# EAGLE design Strain guage (EAGLE 9.6.2)
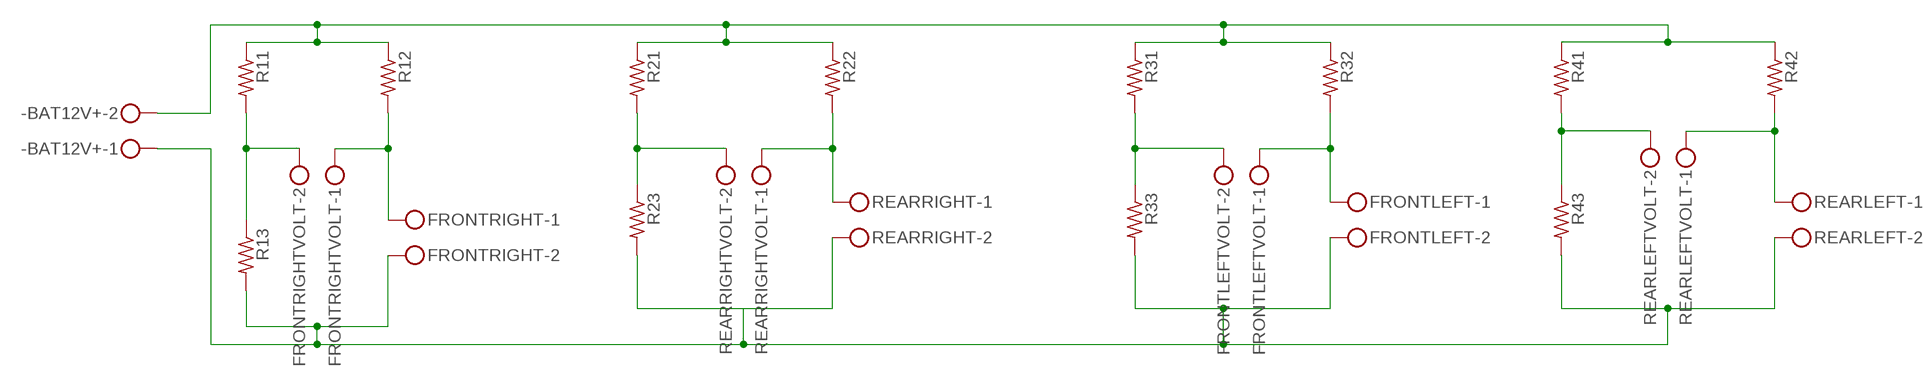
[diagram p0: schematic, sheet 1]

## Parts
-BAT12V+  MKDSN1,5/2-5,08  [MKDSN1,5/2-5,08]
FRONTLEFT  MKDSN1,5/2-5,08  [MKDSN1,5/2-5,08]
FRONTLEFTVOLT  MKDSN1,5/2-5,08  [MKDSN1,5/2-5,08]
FRONTRIGHT  MKDSN1,5/2-5,08  [MKDSN1,5/2-5,08]
FRONTRIGHTVOLT  MKDSN1,5/2-5,08  [MKDSN1,5/2-5,08]
R11  R-US_0204/7  [0204/7]
R12  R-US_0204/7  [0204/7]
R13  R-US_0204/7  [0204/7]
R21  R-US_0204/7  [0204/7]
R22  R-US_0204/7  [0204/7]
R23  R-US_0204/7  [0204/7]
R31  R-US_0204/7  [0204/7]
R32  R-US_0204/7  [0204/7]
R33  R-US_0204/7  [0204/7]
R41  R-US_0204/7  [0204/7]
R42  R-US_0204/7  [0204/7]
R43  R-US_0204/7  [0204/7]
REARLEFT  MKDSN1,5/2-5,08  [MKDSN1,5/2-5,08]
REARLEFTVOLT  MKDSN1,5/2-5,08  [MKDSN1,5/2-5,08]
REARRIGHT  MKDSN1,5/2-5,08  [MKDSN1,5/2-5,08]
REARRIGHTVOLT  MKDSN1,5/2-5,08  [MKDSN1,5/2-5,08]

## Nets
N$1: -BAT12V+.2 R11.1 R12.1 R21.1 R22.1 R31.1 R32.1 R41.1 R42.1
N$2: FRONTRIGHTVOLT.2 R11.2 R13.1
N$3: -BAT12V+.1 FRONTLEFT.2 FRONTRIGHT.2 R13.2 R23.2 R33.2 R43.2 REARLEFT.2 REARRIGHT.2
N$4: FRONTRIGHT.1 FRONTRIGHTVOLT.1 R12.2
N$5: R21.2 R23.1 REARRIGHTVOLT.2
N$8: R22.2 REARRIGHT.1 REARRIGHTVOLT.1
N$9: FRONTLEFTVOLT.2 R31.2 R33.1
N$11: FRONTLEFT.1 FRONTLEFTVOLT.1 R32.2
N$12: R41.2 R43.1 REARLEFTVOLT.2
N$14: R42.2 REARLEFT.1 REARLEFTVOLT.1

## Library data of the parts
-BAT12V+ FRONTLEFT FRONTLEFTVOLT FRONTRIGHT FRONTRIGHTVOLT REARLEFT REARLEFTVOLT REARRIGHT REARRIGHTVOLT = con-phoenix-508:MKDSN1,5/2-5,08: MKDSN 1,5/ 2-5,08 Printklemme Nennstrom: 13,5 A Nennspannung: 250 V Rastermaß: 5,08 mm Polzahl: 2 Anschlussart: Schraubanschluss Montage: Löten Anschlussrichtung Leiter/Platine: 0 ° Artikelnummer: 1729128 Source: http://eshop.phoenixcontact.com .. 1729128.pdf
R11-R13 R21-R23 R31-R33 R41-R43 = rcl:R-US_: RESISTOR, American symbol; SPICEPREFIX: R

## Board
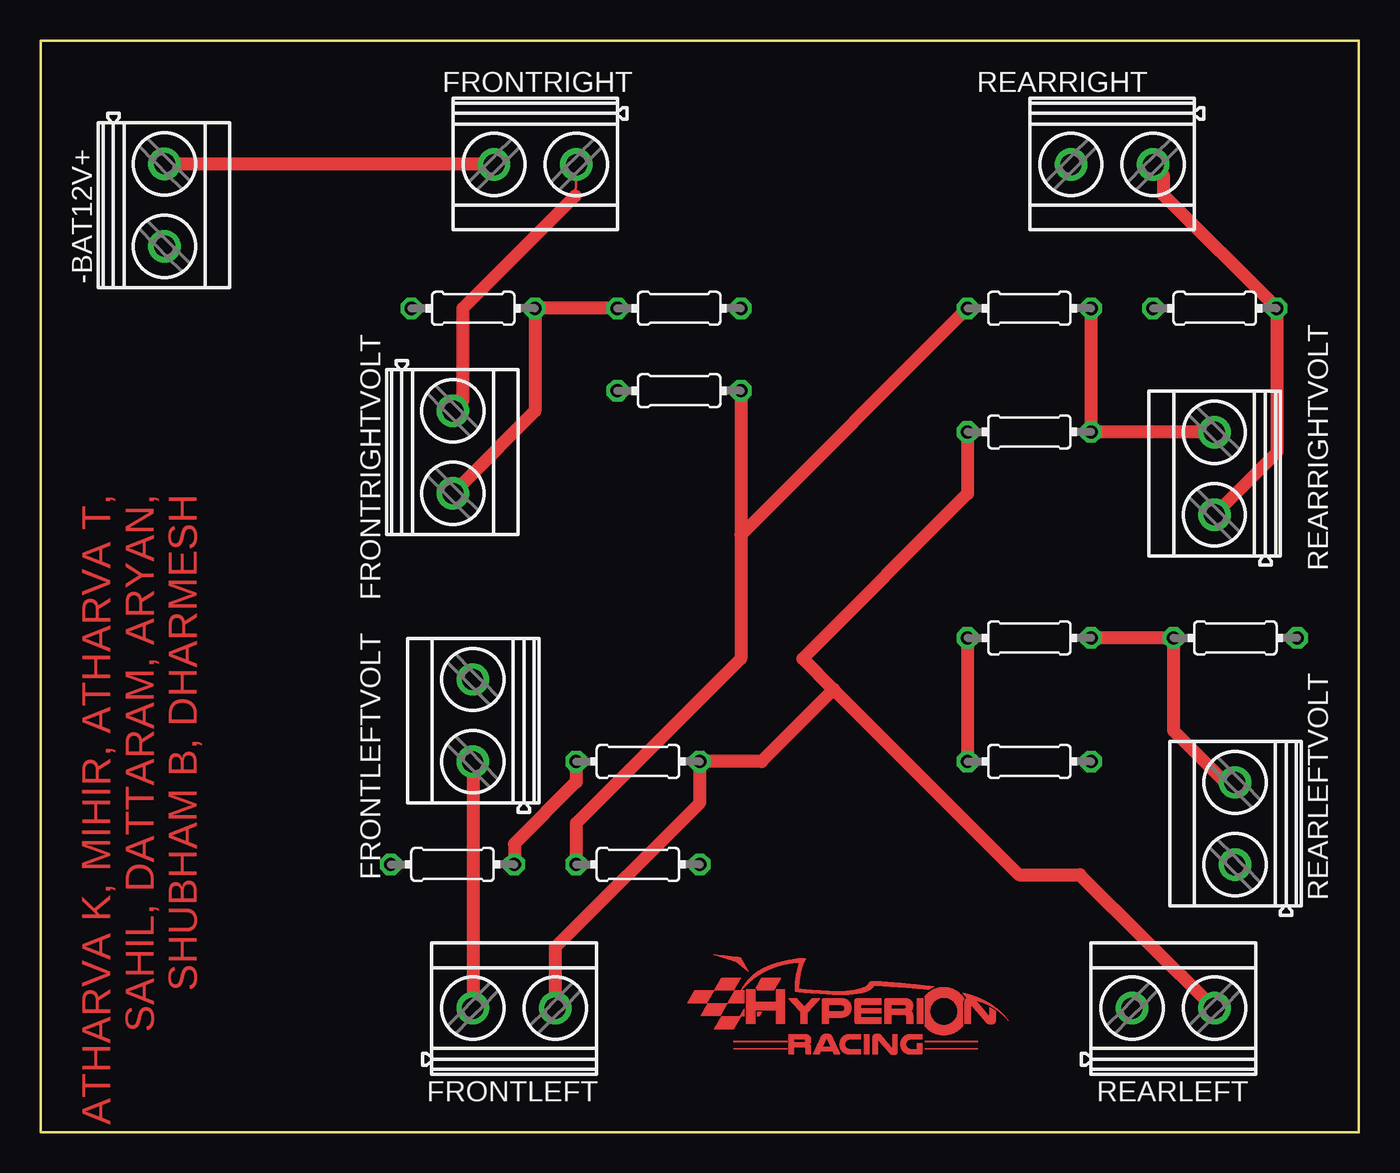
[diagram p1: board, top side]
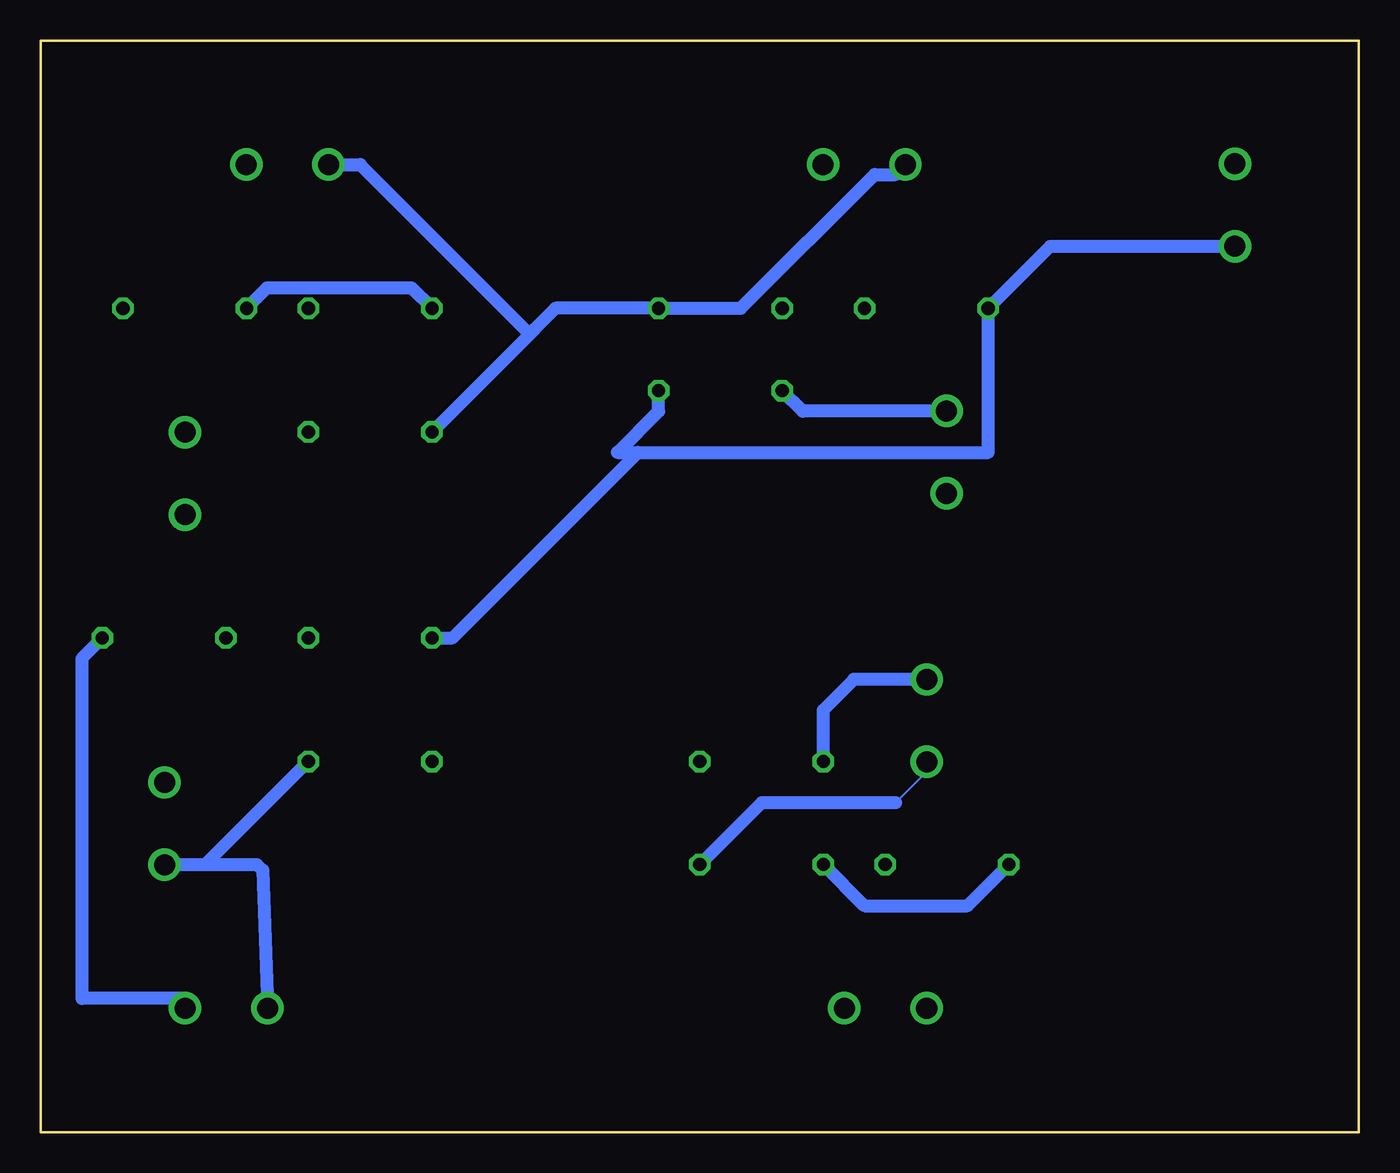
[diagram p2: board, bottom side, seen from below]

Size 81.28 x 67.31 mm. Coordinates in mm from the lower left corner, seen from the top.
Outline: 0,67.31 0,0 81.28,0 81.28,67.31 0,67.31
Copper layers (1*16): Top 0.035mm / dielectric 1.5mm / Bottom 0.035mm
Design rules "default": minimum track width 6mil, minimum drill 0.35mm, track to track 6mil, track to pad 6mil, pad to pad 6mil, via to via 6mil, smd to smd 6mil, copper to edge 40mil, drill to drill 6mil, minimum pad ring 10mil, minimum via ring 8mil, stop-mask expansion 4mil, vias tented up to drill 0mil, thermal gap 10mil

### Footprints (pad centres in the part's own frame; a part is rotated, then mirrored left to right if it is on the bottom)
MKDSN1,5/2-5,08 = drill 1.3 pad 2: 1 -2.561,0.025; 2 2.519,0.025
0204/7 = drill 0.813 octagon: 1 -3.81,0; 2 3.81,0

### Placement (x,y rotation side)
-BAT12V+  7.62,57.15 270 top
FRONTLEFT  29.21,7.62 0 top
FRONTLEFTVOLT  26.67,25.4 90 top
FRONTRIGHT  30.48,59.69 180 top
FRONTRIGHTVOLT  25.4,41.91 270 top
R11  26.67,50.8 0 top
R12  39.37,45.72 180 top
R13  39.37,50.8 0 top
R21  60.96,50.8 0 top
R22  72.39,50.8 0 top
R23  60.96,43.18 180 top
R31  25.4,16.51 0 top
R32  36.83,16.51 0 top
R33  36.83,22.86 0 top
R41  60.96,30.48 0 top
R42  60.96,22.86 0 top
R43  73.66,30.48 0 top
REARLEFT  69.85,7.62 0 top
REARLEFTVOLT  73.66,19.05 90 top
REARRIGHT  66.04,59.69 180 top
REARRIGHTVOLT  72.39,40.64 90 top

### Tracks (layer width: path | path; a pad name or v marks a point on that pad's centre or on a via)
N$1
  Top 0.813: R41.1 R42.1 | R32.1 33.02,19.05 43.18,29.21 43.18,36.83 | R12.1 43.18,36.83 | 43.18,36.83 R21.1
  Bottom 0.152: 8.25,54.61 -BAT12V+.2
  Bottom 0.813: 8.25,54.61 19.05,54.61 R11.1 22.86,41.91 44.45,41.91 | R21.1 58.42,52.07 67.31,52.07 R22.1 | R31.1 24.13,13.97 30.48,13.97 R32.1 | 44.45,41.91 55.88,30.48 R41.1 | R12.1 43.18,44.45 45.72,41.91 44.45,41.91
N$2
  Top 0.152: 26.04,40.01 FRONTRIGHTVOLT.2
  Top 0.813: R13.1 R11.2 30.48,44.45 26.04,40.01
N$3
  Top 0.152: 31.75,8.26 FRONTLEFT.2 | 8.25,59.69 -BAT12V+.1 | 27.94,59.69 FRONTRIGHT.2
  Top 0.813: 31.75,8.26 31.75,11.43 40.64,20.32 R33.2 44.45,22.86 48.89,27.3 | 27.94,59.69 8.25,59.69 | R23.2 57.15,39.37 46.99,29.21 48.89,27.3 | 48.89,27.3 60.33,15.87 64.09,15.87 REARLEFT.2
  Bottom 0.152: 28.57,59.06 FRONTRIGHT.2
  Bottom 0.813: R43.2 78.74,29.21 78.74,8.26 72.39,8.26 REARLEFT.2 | 50.8,49.53 R23.2 | 28.57,59.06 29.85,59.06 38.1,50.8 R13.2 49.53,50.8 51.12,49.21 61.57,59.67 REARRIGHT.2
N$4
  Top 0.152: 32.97,57.74 FRONTRIGHT.1 | 26.04,45.09 FRONTRIGHTVOLT.1
  Top 0.813: 32.97,57.74 26.04,50.8 26.04,45.09
  Bottom 0.152: 26.04,44.45 FRONTRIGHTVOLT.1
  Bottom 0.813: R12.2 34.29,44.45 26.04,44.45
N$5
  Top 0.152: 71.75,43.18 REARRIGHTVOLT.2
  Top 0.813: 71.75,43.18 R23.1 R21.2
N$8
  Top 0.152: 72.39,38.1 REARRIGHTVOLT.1
  Top 0.813: REARRIGHT.1 69.22,59.06 69.22,57.78 R22.2 76.2,41.91 72.39,38.1
N$9
  Top 0.813: R31.2 29.21,17.78 33.02,21.59 R33.1
  Bottom 0.813: R33.1 33.02,26.04 31.14,27.92 FRONTLEFTVOLT.2
N$11
  Top 0.152: 26.67,8.26 FRONTLEFT.1 | 26.67,22.23 FRONTLEFTVOLT.1
  Top 0.813: 26.67,22.23 26.67,8.26
  Bottom 0.152: 28.57,20.32 26.67,22.23 FRONTLEFTVOLT.1
  Bottom 0.813: R32.2 36.83,20.32 28.57,20.32
N$12
  Top 0.813: R41.2 R43.1 69.85,24.77 73.02,21.59 REARLEFTVOLT.2
N$14
  Bottom 0.152: 71.75,16.51 71.12,16.51
  Bottom 0.813: 71.12,16.51 R42.2 | REARLEFTVOLT.1 73.02,16.51 71.75,16.51 67.94,16.51 67.58,16.15 REARLEFT.1
(copper drawn outside any net)
  shapes: Route3 area x2883, Route4 area x2410, Route6 area x4371, Top area x3461

### Text on the board
Top: ATHARVA K, MIHIR, ATHARVA T, / SAHIL, DATTARAM, ARYAN, / SHUBHAM B, DHARMESH